# EAGLE design encoder (EAGLE 9.4.2)
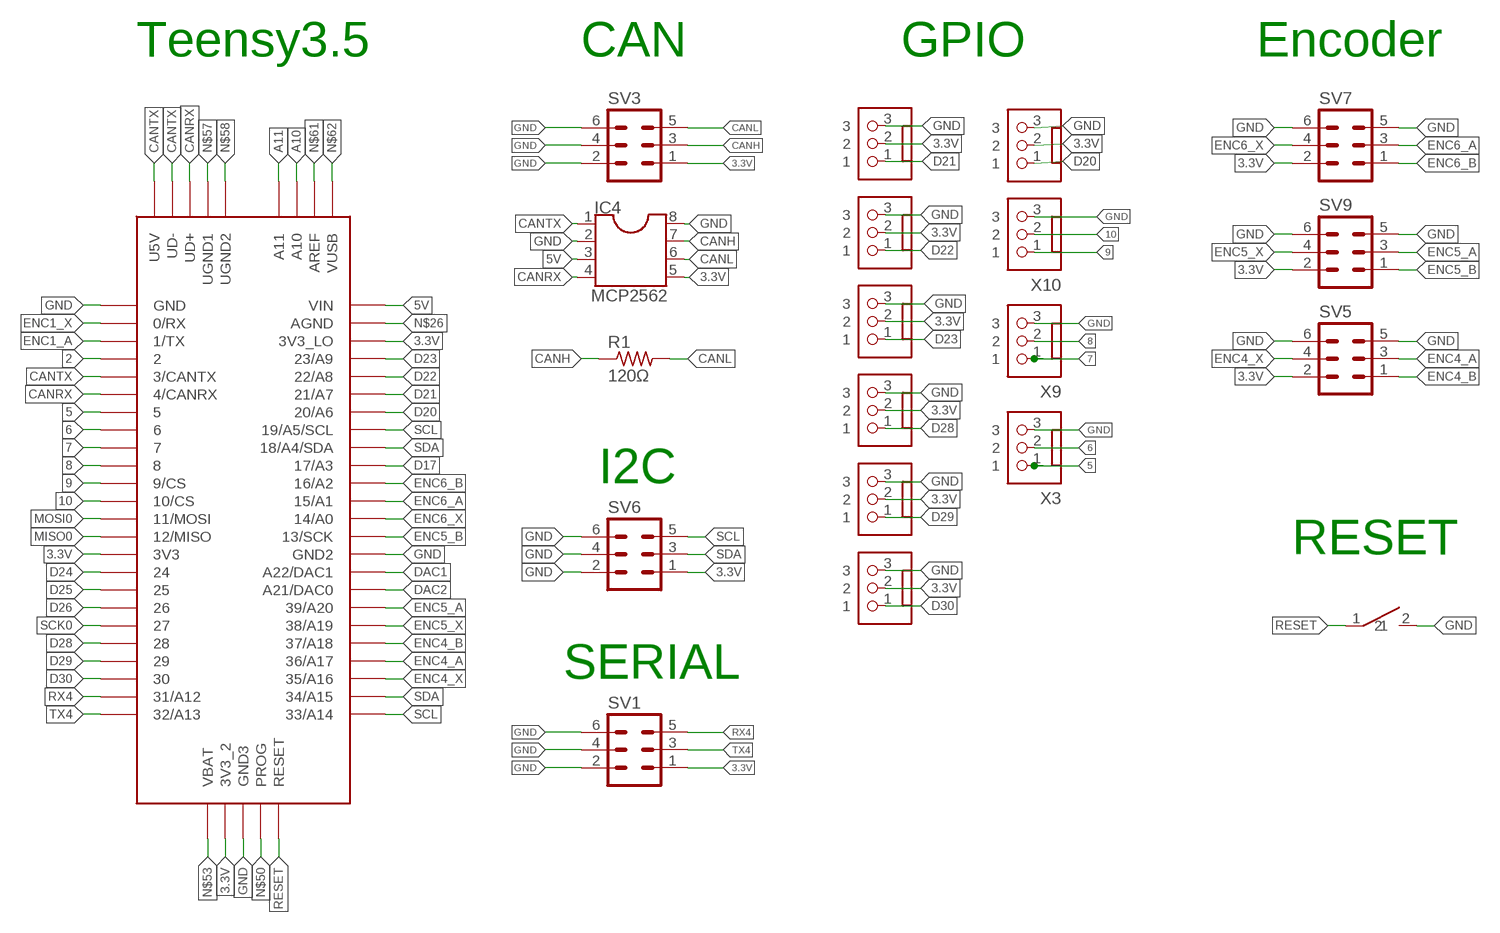
[diagram p0: schematic, sheet 1]

## Parts
IC4  MCP2562  DIL8  [DIL08]
R1  120Ω  R-US_0207/7  [0207/7]
SV1  ML6  [ML6]
SV3  ML6  [ML6]
SV5  ML6  [ML6]
SV6  ML6  [ML6]
SV7  ML6  [ML6]
SV9  ML6  [ML6]
TACT_SWITCH1  TACT_SWITCH  [TACT_SWITCH]
U$1  TEENSY_3.5/3.6  [TEENSY_3.5/3.6]
X3  JST-XH-03-PIN-LONG-PAD  [JST-XH-03-PACKAGE-LONG-PAD]
X6  JST-XH-03-PIN-LONG-PAD  [JST-XH-03-PACKAGE-LONG-PAD]
X7  JST-XH-03-PIN-LONG-PAD  [JST-XH-03-PACKAGE-LONG-PAD]
X8  JST-XH-03-PIN-LONG-PAD  [JST-XH-03-PACKAGE-LONG-PAD]
X9  JST-XH-03-PIN-LONG-PAD  [JST-XH-03-PACKAGE-LONG-PAD]
X10  JST-XH-03-PIN-LONG-PAD  [JST-XH-03-PACKAGE-LONG-PAD]
X12  JST-XH-03-PIN-LONG-PAD  [JST-XH-03-PACKAGE-LONG-PAD]
X13  JST-XH-03-PIN-LONG-PAD  [JST-XH-03-PACKAGE-LONG-PAD]
X14  JST-XH-03-PIN-LONG-PAD  [JST-XH-03-PACKAGE-LONG-PAD]
X15  JST-XH-03-PIN-LONG-PAD  [JST-XH-03-PACKAGE-LONG-PAD]

## Nets
2: U$1.2
3.3V: IC4.5 SV1.1 SV3.1 SV5.2 SV6.1 SV7.2 SV9.2 U$1.3V3 U$1.3V3_2 U$1.3V3_LO X6.2 X7.2 X8.2 X12.2 X13.2 X14.2 X15.2
5: U$1.5 X3.1
5V: IC4.3 U$1.VIN
6: U$1.6 X3.2
7: U$1.7 X9.1
8: U$1.8 X9.2
9: U$1.9/CS X10.1
10: U$1.10/CS X10.2
A10: U$1.A10
A11: U$1.A11
CANH: IC4.7 R1.1 SV3.3
CANL: IC4.6 R1.2 SV3.5
CANRX: IC4.4 U$1.4/CANRX U$1.UD+
CANTX: IC4.1 U$1.3/CANTX U$1.U5V U$1.UD-
D17: U$1.17/A3
D20: U$1.20/A6 X6.1
D21: U$1.21/A7 X7.1
D22: U$1.22/A8 X12.1
D23: U$1.23/A9 X13.1
D24: U$1.24
D25: U$1.25
D26: U$1.26
D28: U$1.28 X8.1
D29: U$1.29 X14.1
D30: U$1.30 X15.1
DAC1: U$1.A22/DAC1
DAC2: U$1.21/DAC0(A21/DAC0)
ENC1_A: U$1.1/TX
ENC1_X: U$1.0/RX
ENC4_A: SV5.3 U$1.36/A17
ENC4_B: SV5.1 U$1.37/A18
ENC4_X: SV5.4 U$1.35/A16
ENC5_A: SV9.3 U$1.39/A20
ENC5_B: SV9.1 U$1.13/SCK
ENC5_X: SV9.4 U$1.38/A19
ENC6_A: SV7.3 U$1.15/A1
ENC6_B: SV7.1 U$1.16/A2
ENC6_X: SV7.4 U$1.14/A0
GND: IC4.2 IC4.8 SV1.2 SV1.4 SV1.6 SV3.2 SV3.4 SV3.6 SV5.5 SV5.6 SV6.2 SV6.4 SV6.6 SV7.5 SV7.6 SV9.5 SV9.6 TACT_SWITCH1.2 U$1.GND U$1.GND2 U$1.GND3 X3.3 X6.3 X7.3 X8.3 X9.3 X10.3 X12.3 X13.3 X14.3 X15.3
MISO0: U$1.12/MISO
MOSI0: U$1.11/MOSI
N$26: U$1.AGND
N$50: U$1.PROG
N$53: U$1.VBAT
N$57: U$1.UGND1
N$58: U$1.UGND2
N$61: U$1.AREF
N$62: U$1.VUSB
RESET: TACT_SWITCH1.1 U$1.RESET
RX4: SV1.5 U$1.31/A12
SCK0: U$1.27
SCL: SV6.5 U$1.19/A5/SCL U$1.33/A14
SDA: SV6.3 U$1.18/A4/SDA U$1.34/A15
TX4: SV1.3 U$1.32/A13

## Notes on the sheet
- Teensy3.5 | CAN | GPIO | Encoder
- I2C
- RESET
- SERIAL

## Library data of the parts
IC4 = ic-package:DIL8: Dual In Line / Socket
R1 = resistor:R-US_: RESISTOR, American symbol
SV1 SV3 SV5-SV7 SV9 = con-ml:ML6: HARTING; OC_FARNELL: unknown; OC_NEWARK: unknown
TACT_SWITCH1 = TactSwitch:TACT_SWITCH
U$1 = Teensy356:TEENSY_3.5/3.6
X3 X6-X10 X12-X15 = Rembrandt Electronics - JST XH Connectors v1-0:JST-XH-03-PIN: JST XH Connector 2 Pin Wire to board connector. Pitch: 2,54 mm, (0.100") Number of pins: 3 Created by Rembrandt Electronics www.rembrandtelectronics.com

## Board
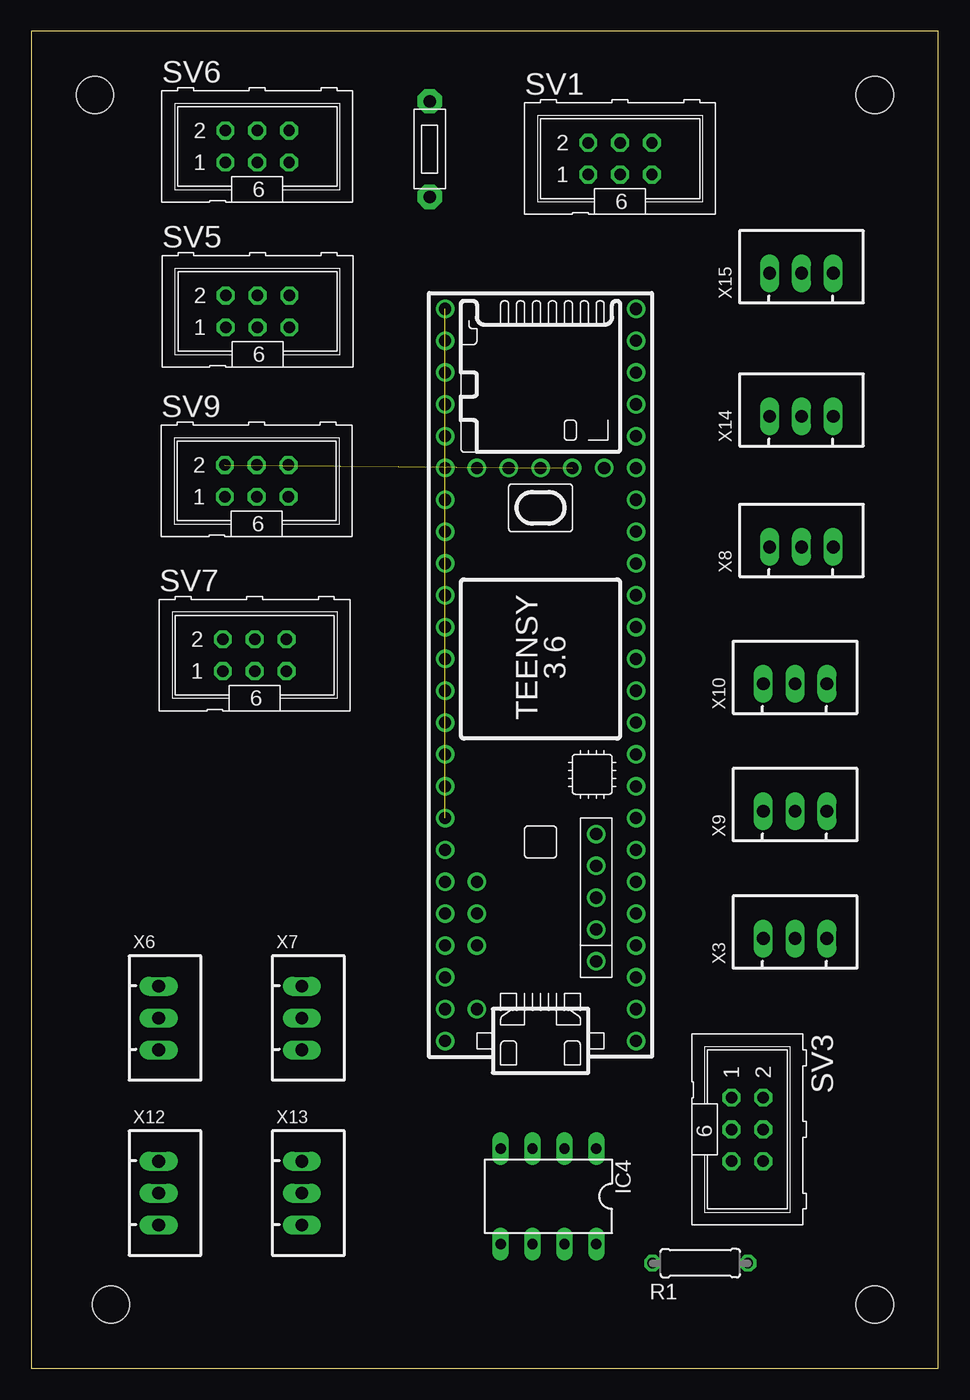
[diagram p1: board, top side]
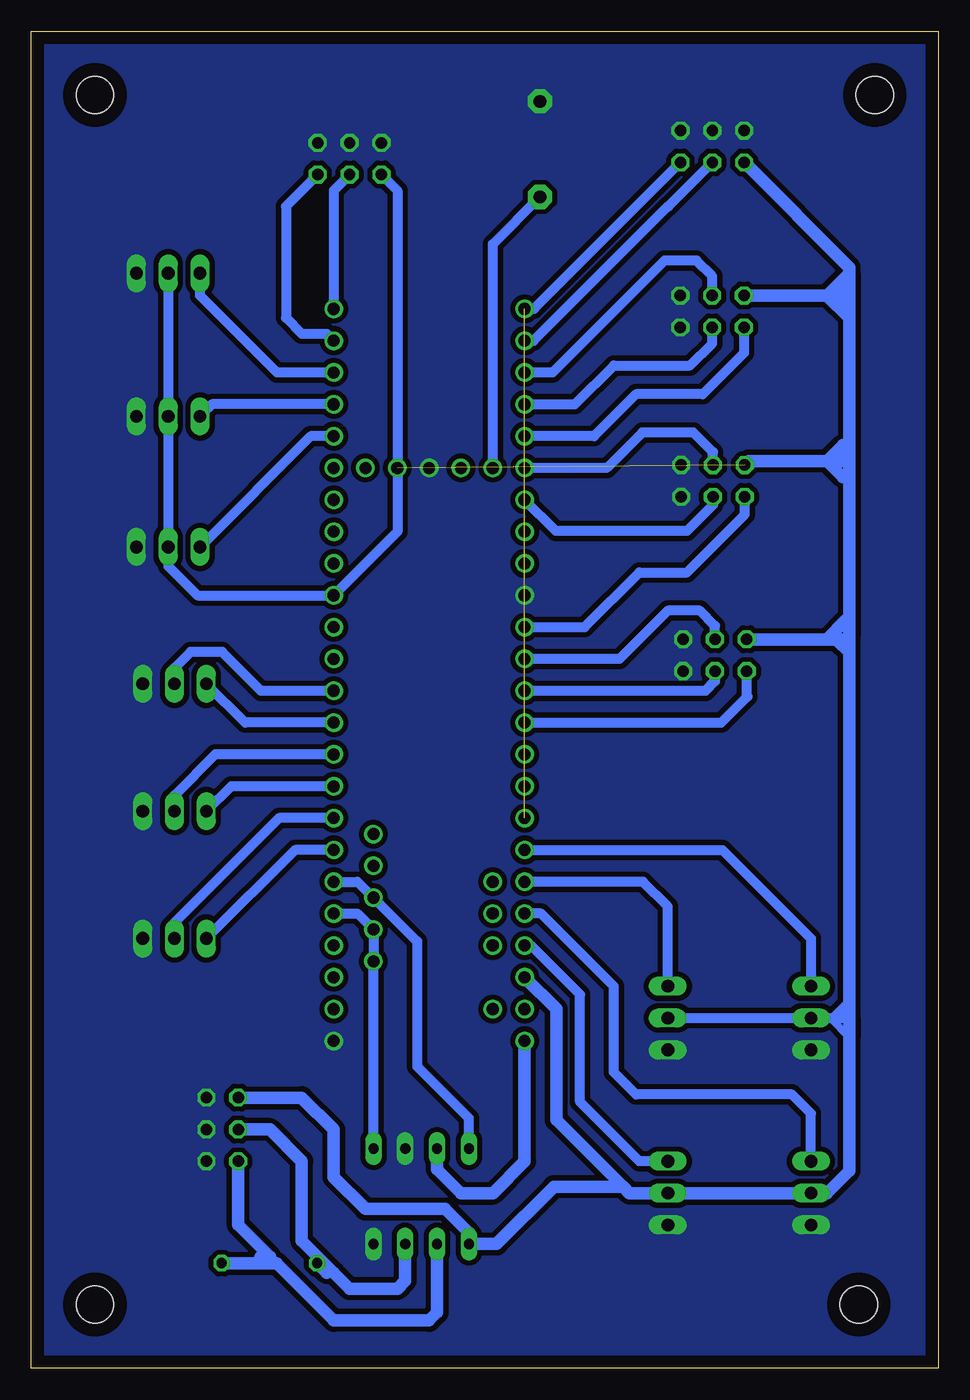
[diagram p2: board, bottom side, seen from below]

Size 72.39 x 106.68 mm. Coordinates in mm from the lower left corner, seen from the top.
Outline: 0,0 72.39,0 72.39,106.68 0,106.68 0,0
Copper layers (1*16): Top 0.035mm / dielectric 1.5mm / Bottom 0.035mm
Design rules "default": minimum track width 6mil, minimum drill 0.35mm, track to track 6mil, track to pad 6mil, pad to pad 6mil, via to via 6mil, smd to smd 6mil, copper to edge 40mil, drill to drill 6mil, minimum pad ring 10mil, minimum via ring 8mil, stop-mask expansion 4mil, vias tented up to drill 0mil, thermal gap 10mil
Holes 3 mm at 5.08,101.6 67.31,101.6 67.31,5.08 6.35,5.08

### Footprints (pad centres in the part's own frame; a part is rotated, then mirrored left to right if it is on the bottom)
DIL08 = drill 0.813 long: 1 -3.81,-3.81; 2 -1.27,-3.81; 3 1.27,-3.81; 4 3.81,-3.81; 5 3.81,3.81; 6 1.27,3.81; 7 -1.27,3.81; 8 -3.81,3.81
0207/7 = drill 0.813 octagon: 1 -3.81,0; 2 3.81,0
ML6 = drill 0.914 octagon: 1 -2.54,-1.27; 2 -2.54,1.27; 3 0,-1.27; 4 0,1.27; 5 2.54,-1.27; 6 2.54,1.27
TACT_SWITCH = drill 1.016 pad 1.93 octagon: 1 -3.81,0; 2 3.81,0
TEENSY_3.5/3.6 = drill 0.965: 0/RX -25.4,-7.62; 1/TX -22.86,-7.62; 2 -20.32,-7.62; 3/CANTX -17.78,-7.62; 3V3 7.62,-7.62; 3V3_2 17.78,-2.54; 3V3_LO -22.86,7.62; 4/CANRX -15.24,-7.62; 5 -12.7,-7.62; 6 -10.16,-7.62; 7 -7.62,-7.62; 8 -5.08,-7.62; 9/CS -2.54,-7.62; 10/CS 0,-7.62; 11/MOSI 2.54,-7.62; 12/MISO 5.08,-7.62; 13/SCK 5.08,7.62; 14/A0 2.54,7.62; 15/A1 0,7.62; 16/A2 -2.54,7.62; 17/A3 -5.08,7.62; 18/A4/SDA -7.62,7.62; 19/A5/SCL -10.16,7.62; 20/A6 -12.7,7.62; 21/A7 -15.24,7.62; 21/DAC0 12.7,7.62; 22/A8 -17.78,7.62; 23/A9 -20.32,7.62; 24 10.16,-7.62; 25 12.7,-7.62; 26 15.24,-7.62; 27 17.78,-7.62; 28 20.32,-7.62; 29 22.86,-7.62; 30 25.4,-7.62; 31/A12 27.94,-7.62; 32/A13 30.48,-7.62; 33/A14 30.48,7.62; 34/A15 27.94,7.62; 35/A16 25.4,7.62; 36/A17 22.86,7.62; 37/A18 20.32,7.62; 38/A19 17.78,7.62; 39/A20 15.24,7.62; A10 -17.78,5.08; A11 -15.24,5.08; A22/DAC1 10.16,7.62; AGND -25.4,7.62; AREF -20.32,5.08; GND -27.94,-7.62; GND2 7.62,7.62; GND3 17.78,0; PROG 17.78,2.54; RESET 17.78,5.08; U5V -21.59,-4.445; UD+ -16.51,-4.445; UD- -19.05,-4.445; UGND1 -13.97,-4.445; UGND2 -11.43,-4.445; VBAT 17.78,-5.08; VIN -27.94,7.62; VUSB -25.4,5.08
JST-XH-03-PACKAGE-LONG-PAD = drill 1.016 long: 1 -2.54,0; 2 0,0; 3 2.54,0

### Placement (x,y rotation side)
IC4  41.27,13.72 180 top
R1  53.39,8.38 0 top
SV1  46.99,96.52 0 top
SV3  57.15,19.05 270 top
SV5  18.05,84.33 0 top
SV6  18.03,97.49 0 top
SV7  17.83,56.9 0 top
SV9  17.99,70.8 0 top
TACT_SWITCH1  31.8,97.28 90 top
U$1  40.64,54.05 90 top
X3  60.96,34.29 0 top
X6  10.16,27.94 270 top
X7  21.59,27.94 270 top
X8  61.47,65.53 0 top
X9  60.96,44.45 0 top
X10  60.96,54.61 0 top
X12  10.16,13.97 270 top
X13  21.59,13.97 270 top
X14  61.47,75.95 0 top
X15  61.47,87.38 0 top

### Tracks (layer width: path | path; a pad name or v marks a point on that pad's centre or on a via)
3.3V  (1 unrouted)
  Bottom 0.61: X6.2 X7.2 | 7.11,26.42 8.64,27.94 X6.2 | X6.2 9.4,27.94
  Bottom 0.813: X15.2 X14.2 X8.2 61.47,64.01 59.13,61.67 U$1.3V3 43.18,66.75 U$1.3V3_2 43.18,93.98 SV1.1 | 15.51,96.2 SV6.1 | 15.45,72.18 SV9.2 | X7.2 7.11,27.94 | 8.64,27.94 8.38,27.94 7.11,29.21
  Bottom 1.016: 25.15,14.48 30.48,19.81 30.48,28.65 U$1.3V3_LO | 25.15,14.48 30.68,14.48 35.26,9.91 IC4.5 37.47,10.79 39.37,12.7 45.72,12.7 48.26,15.24 48.26,19.05 50.8,21.59 SV3.1 | 7.11,57.15 7.11,29.21 7.11,27.94 7.11,26.42 7.11,15.75 8.89,13.97 X12.2 X13.2 24.64,13.97 25.15,14.48 | 7.11,57.15 7.11,58.42 | SV6.1 7.11,87.84 7.11,87.38 | 7.11,87.38 7.11,86.36 | 7.11,86.36 7.11,85.09 | 7.11,85.09 7.11,83.82 | 7.11,83.82 7.11,73.66 | 7.11,73.66 7.11,72.9 | 7.11,72.9 7.11,72.39 | 7.11,72.39 7.11,71.12 | 7.11,71.12 7.11,59.69 | 7.11,59.69 7.11,58.42 | SV7.2 8.89,58.17 | 8.13,58.17 7.37,58.17 7.11,58.42 | SV9.2 15.13,72.39 8.89,72.39 | 7.62,72.39 7.11,72.39 | SV5.2 8.89,85.6 | 8.89,85.6 7.62,85.6 | 7.62,85.6 7.11,85.09 | 7.11,72.9 7.62,72.39 | 7.62,72.39 8.89,72.39 | 8.89,72.39 7.62,71.12 7.11,71.12 | 8.89,58.17 7.37,59.69 7.11,59.69 | 8.89,58.17 8.13,58.17 | 8.13,58.17 7.11,57.15 | 7.62,85.6 7.62,85.85 7.11,86.36 | 8.89,85.6 7.11,83.82 | 8.89,85.6 7.11,87.38 | 8.89,72.39 7.62,73.66 7.11,73.66
5
  Bottom 0.813: U$1.5 51.36,41.35 X3.1
5V
  Bottom 1.016: IC4.3 40.01,15.88 38.1,13.97 35.56,13.97 33.02,16.51 U$1.VIN
6
  Bottom 0.813: X3.2 60.96,35.56 52.63,43.89 U$1.6
7
  Bottom 0.813: U$1.7 56.44,46.43 X9.1
8
  Bottom 0.813: U$1.8 57.71,48.97 60.96,45.72 X9.2
9
  Bottom 0.813: U$1.9/CS 55.32,51.51 X10.1
10
  Bottom 0.813: U$1.10/CS 54.05,54.05 57.15,57.15 59.69,57.15 60.96,55.88 X10.2
CANH
  Bottom 0.813: 48.26,7.62 48.82,7.62
  Bottom 1.016: IC4.7 42.55,6.99 43.18,6.35 46.99,6.35 48.26,7.62 50.8,10.16 50.8,16.51 53.34,19.05 SV3.3 | 48.82,7.62 R1.1
CANL
  Bottom 0.813: 52.83,8.38 53.34,8.89 | 54.61,8.38 54.1,8.89
  Bottom 1.016: IC4.6 40.01,4.45 40.64,3.81 48.26,3.81 52.83,8.38 54.61,8.38 R1.2 | SV3.5 55.88,11.43 53.34,8.89 54.1,8.89
CANRX
  Bottom 0.813: U$1.4/CANRX 46.35,38.81 U$1.UD+ 41.6,34.06 41.6,24.08 37.47,19.94 IC4.4
CANTX
  Bottom 0.813: U$1.3/CANTX 46.35,36.27 U$1.UD- U$1.U5V IC4.1
D20
  Bottom 0.813: U$1.20/A6 17.22,41.35 10.16,34.29 X6.1
D21
  Bottom 0.813: X7.1 21.59,36.83 23.57,38.81 U$1.21/A7
D22
  Bottom 0.813: X12.1 10.16,20.32 11.68,21.84 24.13,21.84 25.91,23.62 25.91,30.48 31.7,36.27 U$1.22/A8
D23
  Bottom 0.61: 32.51,33.73 U$1.23/A9
  Bottom 0.813: X13.1 23.88,16.51 28.6,21.23 28.6,29.82 32.51,33.73
D28
  Bottom 0.813: U$1.28 50.09,74.37 X8.1
D29
  Bottom 0.813: U$1.29 57.96,76.91 X14.1
D30
  Bottom 0.813: U$1.30 52.78,79.45 58.93,85.6 X15.1
ENC4_A
  Bottom 0.813: U$1.36/A17 29,76.91 25.91,80.01 19.81,80.01 18.05,81.77 SV5.3
ENC4_B
  Bottom 0.813: SV5.1 15.51,81.01 18.8,77.72 24.13,77.72 27.48,74.37 U$1.37/A18
ENC4_X
  Bottom 0.813: SV5.4 18.05,87.14 19.3,88.39 21.84,88.39 30.78,79.45 U$1.35/A16
ENC5_A
  Bottom 0.813: SV9.3 17.99,68.88 20.07,66.8 30.53,66.8 U$1.39/A20
ENC5_B
  Bottom 0.813: U$1.13/SCK 28.24,59.13 23.88,63.5 20.07,63.5 15.45,68.12 SV9.1
ENC5_X
  Bottom 0.813: SV9.4 17.99,73.1 19.56,74.68 23.62,74.68 26.46,71.83 U$1.38/A19
ENC6_A
  Bottom 0.813: SV7.3 17.83,54.82 18.59,54.05 U$1.15/A1
ENC6_B
  Bottom 0.61: 15.24,53.59 15.29,53.64
  Bottom 0.813: U$1.16/A2 17.32,51.51 15.24,53.59 | 15.29,53.64 SV7.1
ENC6_X
  Bottom 0.813: SV7.4 17.83,59.23 19.05,60.45 21.59,60.45 25.45,56.59 U$1.14/A0
GND
  pour Bottom (isolate 0.406, no thermals): 0,0 72.39,0 72.39,106.68 0,106.68
RESET
  Bottom 0.813: U$1.RESET 35.56,89.71 TACT_SWITCH1.1
RX4
  Bottom 0.813: SV1.5 52.07,92.71 52.07,83.82 50.8,82.55 48.82,82.55 U$1.31/A12
SCL  (1 unrouted)
  Bottom 0.813: SV6.5 32.26,84.53 U$1.33/A14
SDA  (1 unrouted)
  Bottom 0.813: U$1.34/A15 32.31,81.99 21.59,92.71 21.54,92.71 SV6.3
TX4
  Bottom 0.813: SV1.3 48.26,93.98 U$1.32/A13